# Altium schematic sheet S7CAS-PLEIADES-CARTE-MERE_P20_DDR3-FPGA-Bank-3.SchDoc
size Tabloid; SheetNumber: 6; SheetTotal: 20; Sheet_Name: DDR3; Size: 11x17
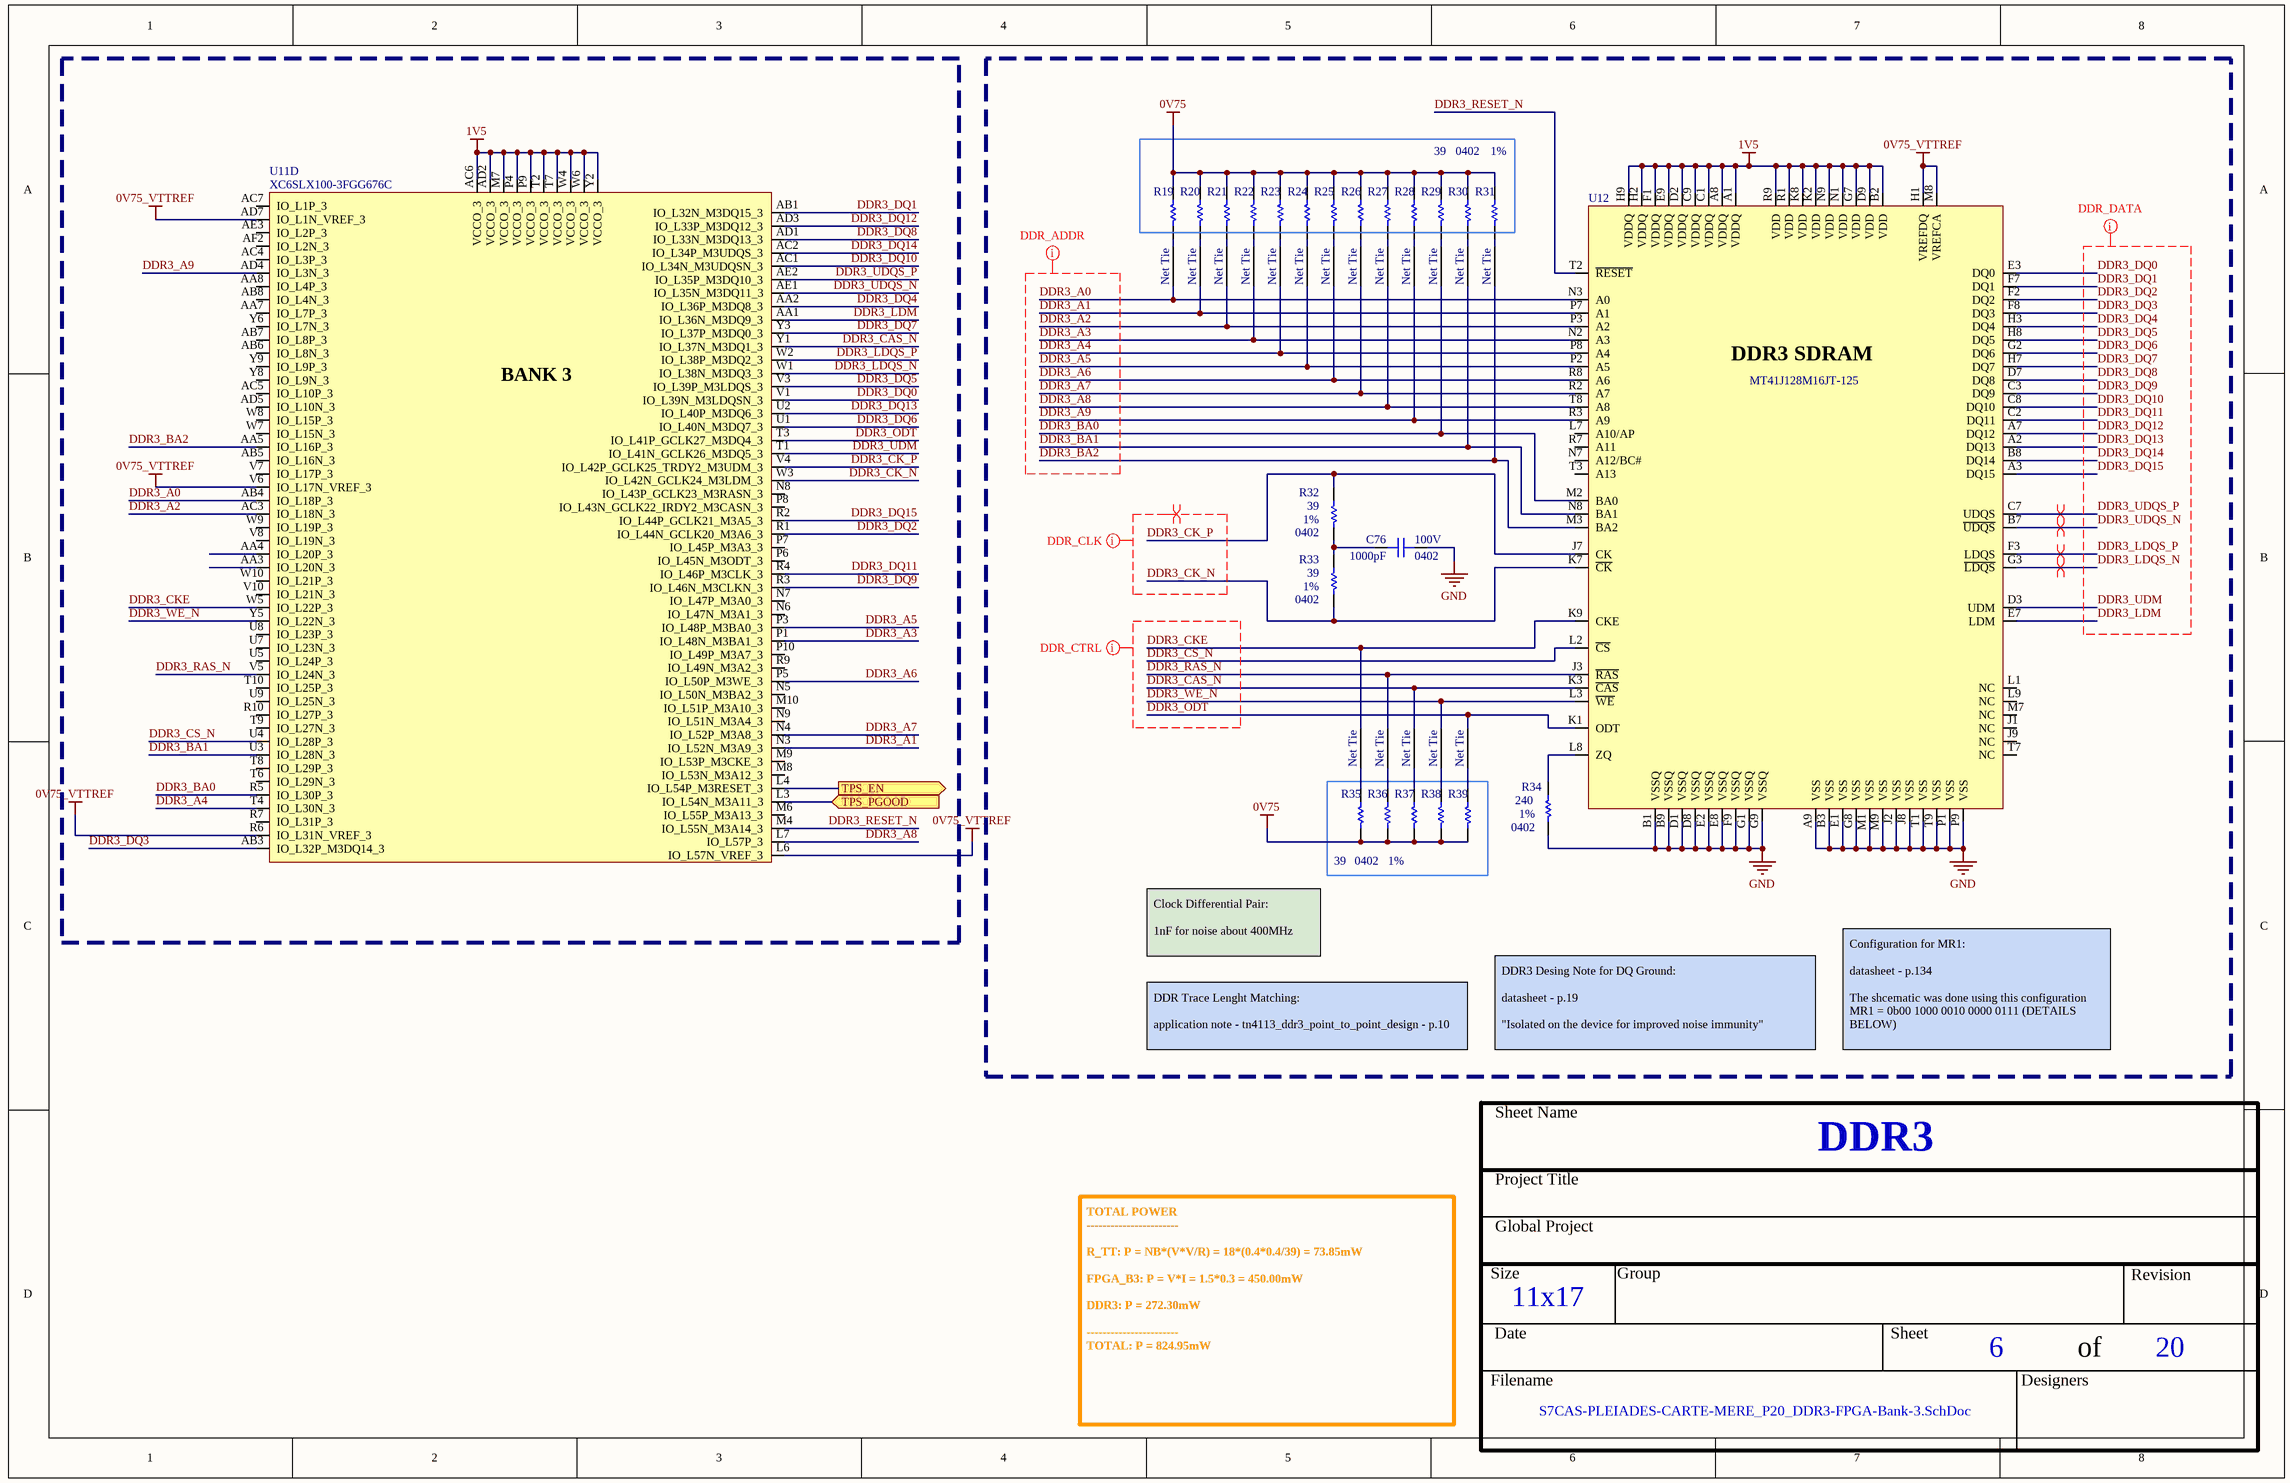
[diagram p0: S7CAS-PLEIADES-CARTE-MERE_P20_DDR3-FPGA-Bank-3.SchDoc]

## Parts
C76  value 1000pF  Voltage: 100V  Package: 0402  [CAP_0402]  (hidden comment: CAP - 0402)
NT1  Net Tie  [Net Tie]  (net tie, no BOM)
NT2  Net Tie  [Net Tie]  (net tie, no BOM)
NT3  Net Tie  [Net Tie]  (net tie, no BOM)
NT4  Net Tie  [Net Tie]  (net tie, no BOM)
NT5  Net Tie  [Net Tie]  (net tie, no BOM)
NT6  Net Tie  [Net Tie]  (net tie, no BOM)
NT7  Net Tie  [Net Tie]  (net tie, no BOM)
NT8  Net Tie  [Net Tie]  (net tie, no BOM)
NT9  Net Tie  [Net Tie]  (net tie, no BOM)
NT10  Net Tie  [Net Tie]  (net tie, no BOM)
NT11  Net Tie  [Net Tie]  (net tie, no BOM)
NT12  Net Tie  [Net Tie]  (net tie, no BOM)
NT13  Net Tie  [Net Tie]  (net tie, no BOM)
NT14  Net Tie  [Net Tie]  (net tie, no BOM)
NT15  Net Tie  [Net Tie]  (net tie, no BOM)
NT16  Net Tie  [Net Tie]  (net tie, no BOM)
NT17  Net Tie  [Net Tie]  (net tie, no BOM)
NT18  Net Tie  [Net Tie]  (net tie, no BOM)
R19  value 39  Package: 0402  Precision: 1%  [RES_0402]  (hidden comment: RES - 0402)
R20  RES - 0402  [RES_0402]  (value not drawn)
R21  RES - 0402  [RES_0402]  (value not drawn)
R22  RES - 0402  [RES_0402]  (value not drawn)
R23  RES - 0402  [RES_0402]  (value not drawn)
R24  RES - 0402  [RES_0402]  (value not drawn)
R25  RES - 0402  [RES_0402]  (value not drawn)
R26  RES - 0402  [RES_0402]  (value not drawn)
R27  RES - 0402  [RES_0402]  (value not drawn)
R28  RES - 0402  [RES_0402]  (value not drawn)
R29  RES - 0402  [RES_0402]  (value not drawn)
R30  RES - 0402  [RES_0402]  (value not drawn)
R31  RES - 0402  [RES_0402]  (value not drawn)
R32  value 39  Package: 0402  Precision: 1%  [RES_0402]  (hidden comment: RES - 0402)
R33  value 39  Package: 0402  Precision: 1%  [RES_0402]  (hidden comment: RES - 0402)
R34  value 240  Package: 0402  Precision: 1%  [RES_0402]  (hidden comment: RES - 0402)
R35  value 39  Package: 0402  Precision: 1%  [RES_0402]  (hidden comment: RES - 0402)
R36  RES - 0402  [RES_0402]  (value not drawn)
R37  RES - 0402  [RES_0402]  (value not drawn)
R38  RES - 0402  [RES_0402]  (value not drawn)
R39  RES - 0402  [RES_0402]  (value not drawn)
U11  XC6SLX100-3FGG676C  [FPGA_XILINX_FGG676]  (part D of 10)
U12  MT41J128M16JT-125  [MEM_DDR3_MT41J128M16JT-125]

## Ports
TPS_EN (out), TPS_PGOOD (in)

## Nets
0V75: R19.2 R20.2 R21.2 R22.2 R23.2 R24.2 R25.2 R26.2 R27.2 R28.2 R29.2 R30.2 R31.2 R35.1 R36.1 R37.1 R38.1 R39.1
0V75_VTTREF: U11.AD7(IO_L1N_VREF_3) U11.L6(IO_L57N_VREF_3) U11.R6(IO_L31N_VREF_3) U11.V6(IO_L17N_VREF_3) U12.H1(VREFDQ) U12.M8(VREFCA)
1V5: U11.AC6(VCCO_3) U11.AD2(VCCO_3) U11.M7(VCCO_3) U11.P4(VCCO_3) U11.P9(VCCO_3) U11.T2(VCCO_3) U11.T7(VCCO_3) U11.W4(VCCO_3) U11.W6(VCCO_3) U11.Y2(VCCO_3) U12.A1(VDDQ) U12.A8(VDDQ) U12.B2(VDD) U12.C1(VDDQ) U12.C9(VDDQ) U12.D2(VDDQ) U12.D9(VDD) U12.E9(VDDQ) U12.F1(VDDQ) U12.G7(VDD) U12.H2(VDDQ) U12.H9(VDDQ) U12.K2(VDD) U12.K8(VDD) U12.N1(VDD) U12.N9(VDD) U12.R1(VDD) U12.R9(VDD)
GND: C76.1 R34.1 U12.A9(VSS) U12.B1(VSSQ) U12.B3(VSS) U12.B9(VSSQ) U12.D1(VSSQ) U12.D8(VSSQ) U12.E1(VSS) U12.E2(VSSQ) U12.E8(VSSQ) U12.F9(VSSQ) U12.G1(VSSQ) U12.G8(VSS) U12.G9(VSSQ) U12.J2(VSS) U12.J8(VSS) U12.M1(VSS) U12.M9(VSS) U12.P1(VSS) U12.P9(VSS) U12.T1(VSS) U12.T9(VSS)
DDR3_A0: NT1.1 U11.AB4(IO_L18P_3) U12.N3(A0)
DDR3_A1: NT2.1 U11.N3(IO_L52N_M3A9_3) U12.P7(A1)
DDR3_A2: NT3.1 U11.AC3(IO_L18N_3) U12.P3(A2)
DDR3_A3: NT4.1 U11.P1(IO_L48N_M3BA1_3) U12.N2(A3)
DDR3_A4: NT5.1 U11.T4(IO_L30N_3) U12.P8(A4)
DDR3_A5: NT6.1 U11.P3(IO_L48P_M3BA0_3) U12.P2(A5)
DDR3_A6: NT7.1 U11.P5(IO_L50P_M3WE_3) U12.R8(A6)
DDR3_A7: NT8.1 U11.N4(IO_L52P_M3A8_3) U12.R2(A7)
DDR3_A8: NT9.1 U11.L7(IO_L57P_3) U12.T8(A8)
DDR3_A9: NT10.1 U11.AD4(IO_L3N_3) U12.R3(A9)
DDR3_BA0: NT11.1 U11.R5(IO_L30P_3) U12.M2(BA0)
DDR3_BA1: NT12.1 U11.U3(IO_L28N_3) U12.N8(BA1)
DDR3_BA2: NT13.1 U11.AA5(IO_L16P_3) U12.M3(BA2)
DDR3_CAS_N: NT16.2 U11.Y1(IO_L37N_M3DQ1_3) U12.K3(~{CAS})
DDR3_CK_N: R33.1 U11.W3(IO_L42N_GCLK24_M3LDM_3) U12.K7(~{CK})
DDR3_CK_P: R32.2 U11.V4(IO_L42P_GCLK25_TRDY2_M3UDM_3) U12.J7(CK)
DDR3_CKE: NT14.2 U11.W5(IO_L22P_3) U12.K9(CKE)
DDR3_CS_N: U11.U4(IO_L28P_3) U12.L2(~{CS})
DDR3_DQ0: U11.V1(IO_L39N_M3LDQSN_3) U12.E3(DQ0)
DDR3_DQ1: U11.AB1(IO_L32N_M3DQ15_3) U12.F7(DQ1)
DDR3_DQ2: U11.R1(IO_L44N_GCLK20_M3A6_3) U12.F2(DQ2)
DDR3_DQ3: U11.AB3(IO_L32P_M3DQ14_3) U12.F8(DQ3)
DDR3_DQ4: U11.AA2(IO_L36P_M3DQ8_3) U12.H3(DQ4)
DDR3_DQ5: U11.V3(IO_L39P_M3LDQS_3) U12.H8(DQ5)
DDR3_DQ6: U11.U1(IO_L40N_M3DQ7_3) U12.G2(DQ6)
DDR3_DQ7: U11.Y3(IO_L37P_M3DQ0_3) U12.H7(DQ7)
DDR3_DQ8: U11.AD1(IO_L33N_M3DQ13_3) U12.D7(DQ8)
DDR3_DQ9: U11.R3(IO_L46N_M3CLKN_3) U12.C3(DQ9)
DDR3_DQ10: U11.AC1(IO_L34N_M3UDQSN_3) U12.C8(DQ10)
DDR3_DQ11: U11.R4(IO_L46P_M3CLK_3) U12.C2(DQ11)
DDR3_DQ12: U11.AD3(IO_L33P_M3DQ12_3) U12.A7(DQ12)
DDR3_DQ13: U11.U2(IO_L40P_M3DQ6_3) U12.A2(DQ13)
DDR3_DQ14: U11.AC2(IO_L34P_M3UDQS_3) U12.B8(DQ14)
DDR3_DQ15: U11.R2(IO_L44P_GCLK21_M3A5_3) U12.A3(DQ15)
DDR3_LDM: U11.AA1(IO_L36N_M3DQ9_3) U12.E7(LDM)
DDR3_LDQS_N: U11.W1(IO_L38N_M3DQ3_3) U12.G3(~{LDQS})
DDR3_LDQS_P: U11.W2(IO_L38P_M3DQ2_3) U12.F3(LDQS)
DDR3_ODT: NT18.2 U11.T3(IO_L41P_GCLK27_M3DQ4_3) U12.K1(ODT)
DDR3_RAS_N: NT15.2 U11.V5(IO_L24N_3) U12.J3(~{RAS})
DDR3_RESET_N: U11.M4(IO_L55N_M3A14_3) U12.T2(~{RESET})
DDR3_UDM: U11.T1(IO_L41N_GCLK26_M3DQ5_3) U12.D3(UDM)
DDR3_UDQS_N: U11.AE1(IO_L35N_M3DQ11_3) U12.B7(~{UDQS})
DDR3_UDQS_P: U11.AE2(IO_L35P_M3DQ10_3) U12.C7(UDQS)
DDR3_WE_N: NT17.2 U11.Y5(IO_L22N_3) U12.L3(~{WE})
TPS_EN: U11.L4(IO_L54P_M3RESET_3) ; port TPS_EN
TPS_PGOOD: U11.L3(IO_L54N_M3A11_3) ; port TPS_PGOOD
NetC76_2: C76.2 R32.1 R33.2
NetNT1_2: NT1.2 R19.1
NetNT2_2: NT2.2 R20.1
NetNT3_2: NT3.2 R21.1
NetNT4_2: NT4.2 R22.1
NetNT5_2: NT5.2 R23.1
NetNT6_2: NT6.2 R24.1
NetNT7_2: NT7.2 R25.1
NetNT8_2: NT8.2 R26.1
NetNT9_2: NT9.2 R27.1
NetNT10_2: NT10.2 R28.1
NetNT11_2: NT11.2 R29.1
NetNT12_2: NT12.2 R30.1
NetNT13_2: NT13.2 R31.1
NetNT14_1: NT14.1 R35.2
NetNT15_1: NT15.1 R36.2
NetNT16_1: NT16.1 R37.2
NetNT17_1: NT17.1 R38.2
NetNT18_1: NT18.1 R39.2
NetR34_2: R34.2 U12.L8(ZQ)

Not connected (* = marked no-connect by the designer): U11 AA3(IO_L20N_3) AA4(IO_L20P_3) AA7(IO_L7P_3) AA8(IO_L4P_3) AB5(IO_L16N_3) AB6(IO_L8N_3) AB7(IO_L8P_3) AB8(IO_L4N_3) AC4(IO_L3P_3) AC5(IO_L10P_3) AC7(IO_L1P_3) AD5(IO_L10N_3) AE3(IO_L2P_3) AF2(IO_L2N_3) M6(IO_L55P_M3A13_3) M8(IO_L53N_M3A12_3) M9(IO_L53P_M3CKE_3) M10(IO_L51P_M3A10_3) N5(IO_L50N_M3BA2_3) N6(IO_L47N_M3A1_3) N7(IO_L47P_M3A0_3) N8(IO_L43P_GCLK23_M3RASN_3) N9(IO_L51N_M3A4_3) P6(IO_L45N_M3ODT_3) P7(IO_L45P_M3A3_3) P8(IO_L43N_GCLK22_IRDY2_M3CASN_3) P10(IO_L49P_M3A7_3) R7(IO_L31P_3) R9(IO_L49N_M3A2_3) R10(IO_L27P_3) T6(IO_L29N_3) T8(IO_L29P_3) T9(IO_L27N_3) T10(IO_L25P_3) U5(IO_L24P_3) U7(IO_L23N_3) U8(IO_L23P_3) U9(IO_L25N_3) V7(IO_L17P_3) V8(IO_L19N_3) V10(IO_L21N_3) W7(IO_L15N_3) W8(IO_L15P_3) W9(IO_L19P_3) W10(IO_L21P_3) Y6(IO_L7N_3) Y8(IO_L9N_3) Y9(IO_L9P_3); U12 J1(NC) J9(NC) L1(NC) L7(A10/AP) L9(NC) M7(NC) N7(A12/BC#) R7(A11) T3(A13) T7(NC)

## Layout directives
net class TRACKS_40; net class DDR_ADDR: DDR3_A0, DDR3_A1, DDR3_A2, DDR3_A3, DDR3_A4, DDR3_A5, DDR3_A6, DDR3_A7, DDR3_A8, DDR3_A9, DDR3_BA0, DDR3_BA1, DDR3_BA2
net class TRACKS_40; net class DDR_DATA: DDR3_DQ0, DDR3_DQ1, DDR3_DQ2, DDR3_DQ3, DDR3_DQ4, DDR3_DQ5, DDR3_DQ6, DDR3_DQ7, DDR3_DQ8, DDR3_DQ9, DDR3_DQ10, DDR3_DQ11, DDR3_DQ12, DDR3_DQ13, DDR3_DQ14, DDR3_DQ15, DDR3_LDM, DDR3_LDQS_N, DDR3_LDQS_P, DDR3_UDM, DDR3_UDQS_N, DDR3_UDQS_P
differential pair: DDR3_CK_N, DDR3_CK_P, DDR3_LDQS_N, DDR3_LDQS_P, DDR3_UDQS_N, DDR3_UDQS_P
net class TRACKS_40; net class DDR_CTRL: DDR3_CAS_N, DDR3_CKE, DDR3_CS_N, DDR3_ODT, DDR3_RAS_N, DDR3_WE_N
net class TRACKS_40; net class DDR_CLK: DDR3_CK_N, DDR3_CK_P

## Notes on the sheet
- Clock Differential Pair:
  1nF for noise about 400MHz
- DDR Trace Lenght Matching:
  application note - tn4113_ddr3_point_to_point_design - p.10
- DDR3 Desing Note for DQ Ground:
  datasheet - p.19
  "Isolated on the device for improved noise immunity"
- Configuration for MR1:
  datasheet - p.134
  The shcematic was done using this configuration MR1 = 0b00 1000 0010 0000 0111 (DETAILS BELOW)
  17 = 0
  16 = 0
  15 = 1
  14 = 0
  13 = 0
  12 = 0
  11 = 0
  10 = 0
  9 = 1
  8 = 0
  7 = 0
  6 = 0
  5 = 0
  4 = 0
  3 = 0
  2 = 1
  1 = 1
  0 = 1
- TOTAL POWER
  -----------------------
  R_TT: P = NB*(V*V/R) = 18*(0.4*0.4/39) = 73.85mW
  FPGA_B3: P = V*I = 1.5*0.3 = 450.00mW
  DDR3: P = 272.30mW
  -----------------------
  TOTAL: P = 824.95mW
- Sheet Name
- Project Title
- Global Project
- Size
- Group
- Revision
- Date
- Sheet
- of
- Filename
- Designers
- (in symbol FPGA_XC6SLX100-3FGG676C, part D) BANK 3
- (in symbol MEM_DDR3_MT41J128M16JT-125:K TR) DDR3 SDRAM

## Library data of the parts
C76 = CAP - 0402: Mfg Part Number: GRM155R72A102KA01; Precision: 10%; Current: *; CreatedBy: Jonathan Bouchard; Power: *
NT1-NT18 = NET_TIE: Net Tie for DDR3 lenght matching; GRAMS Lib Spec: 2.7
R19 = RES - 0402: Mfg Part Number: RL0510S-390-F; Voltage: 50V; Power: 1/16W; Current: *; CreatedBy: Jonathan Bouchard
R20-R31 = RES - 0402: Mfg Part Number: RL0510S-390-F; Voltage: 50V; Power: 1/16W; Precision: 1%; Value: 39; Current: *; CreatedBy: Jonathan Bouchard; Package: 0402
R32 R33 R35 = RES - 0402: Mfg Part Number: RL0510S-390-F; Voltage: 50; Power: 1/16W; Current: *; CreatedBy: Jonathan Bouchard
R34 = RES - 0402: Mfg Part Number: ERA-2AEB241X; Voltage: 50V; Power: 1/2W; Current: *; CreatedBy: Jonathan Bouchard
R36-R39 = RES - 0402: Mfg Part Number: RL0510S-390-F; Voltage: 50; Power: 1/16W; Precision: 1%; Value: 39; Current: *; CreatedBy: Jonathan Bouchard; Package: 0402
U11 = FPGA_XC6SLX100-3FGG676C: FPGA - XILINX SPARTAN 6 480 I/O - BGA-676; Voltage: 1.14 V ~ 1.26 V; Current: *; Power: *; Mfg: Xilinx; Mfg Part Number: XC6SLX100-3FGG676C; HelpURL: https://www.xilinx.com/support/documentation/data_sheets/ds162.pdf; CreatedBy: Jonathan Bouchard; Temperature: 0°C ~ 85°C (TJ); Value: *; Precision: *; Package: BGA-676; Supplier 1: Digikey; Supplier Part Number 1: 122-1760-ND
U12 = MEM_DDR3_MT41J128M16JT-125:K TR: MEM - DDR3 SDRAM 2GBIT 800MHZ - TFBGA-96; Voltage: 1.425 V ~ 1.575 V; Mfg: Micrel; Current: *; Power: *; Mfg Part Number: MT41J128M16JT-125; HelpURL: http://www.micron.com/~/media/Documents/Products/Data%20Sheet/DRAM/DDR3/2Gb_DDR3_SDRAM.pdf; CreatedBy: Jonathan Bouchard; Temperature: 0°C ~ 95°C (TC); Value: *; Precision: *; Package: TFBGA-96; Supplier 1: Digikey; Supplier Part Number 1: 557-1611-1-ND